# EAGLE schematic Rev A (EAGLE 6.4)
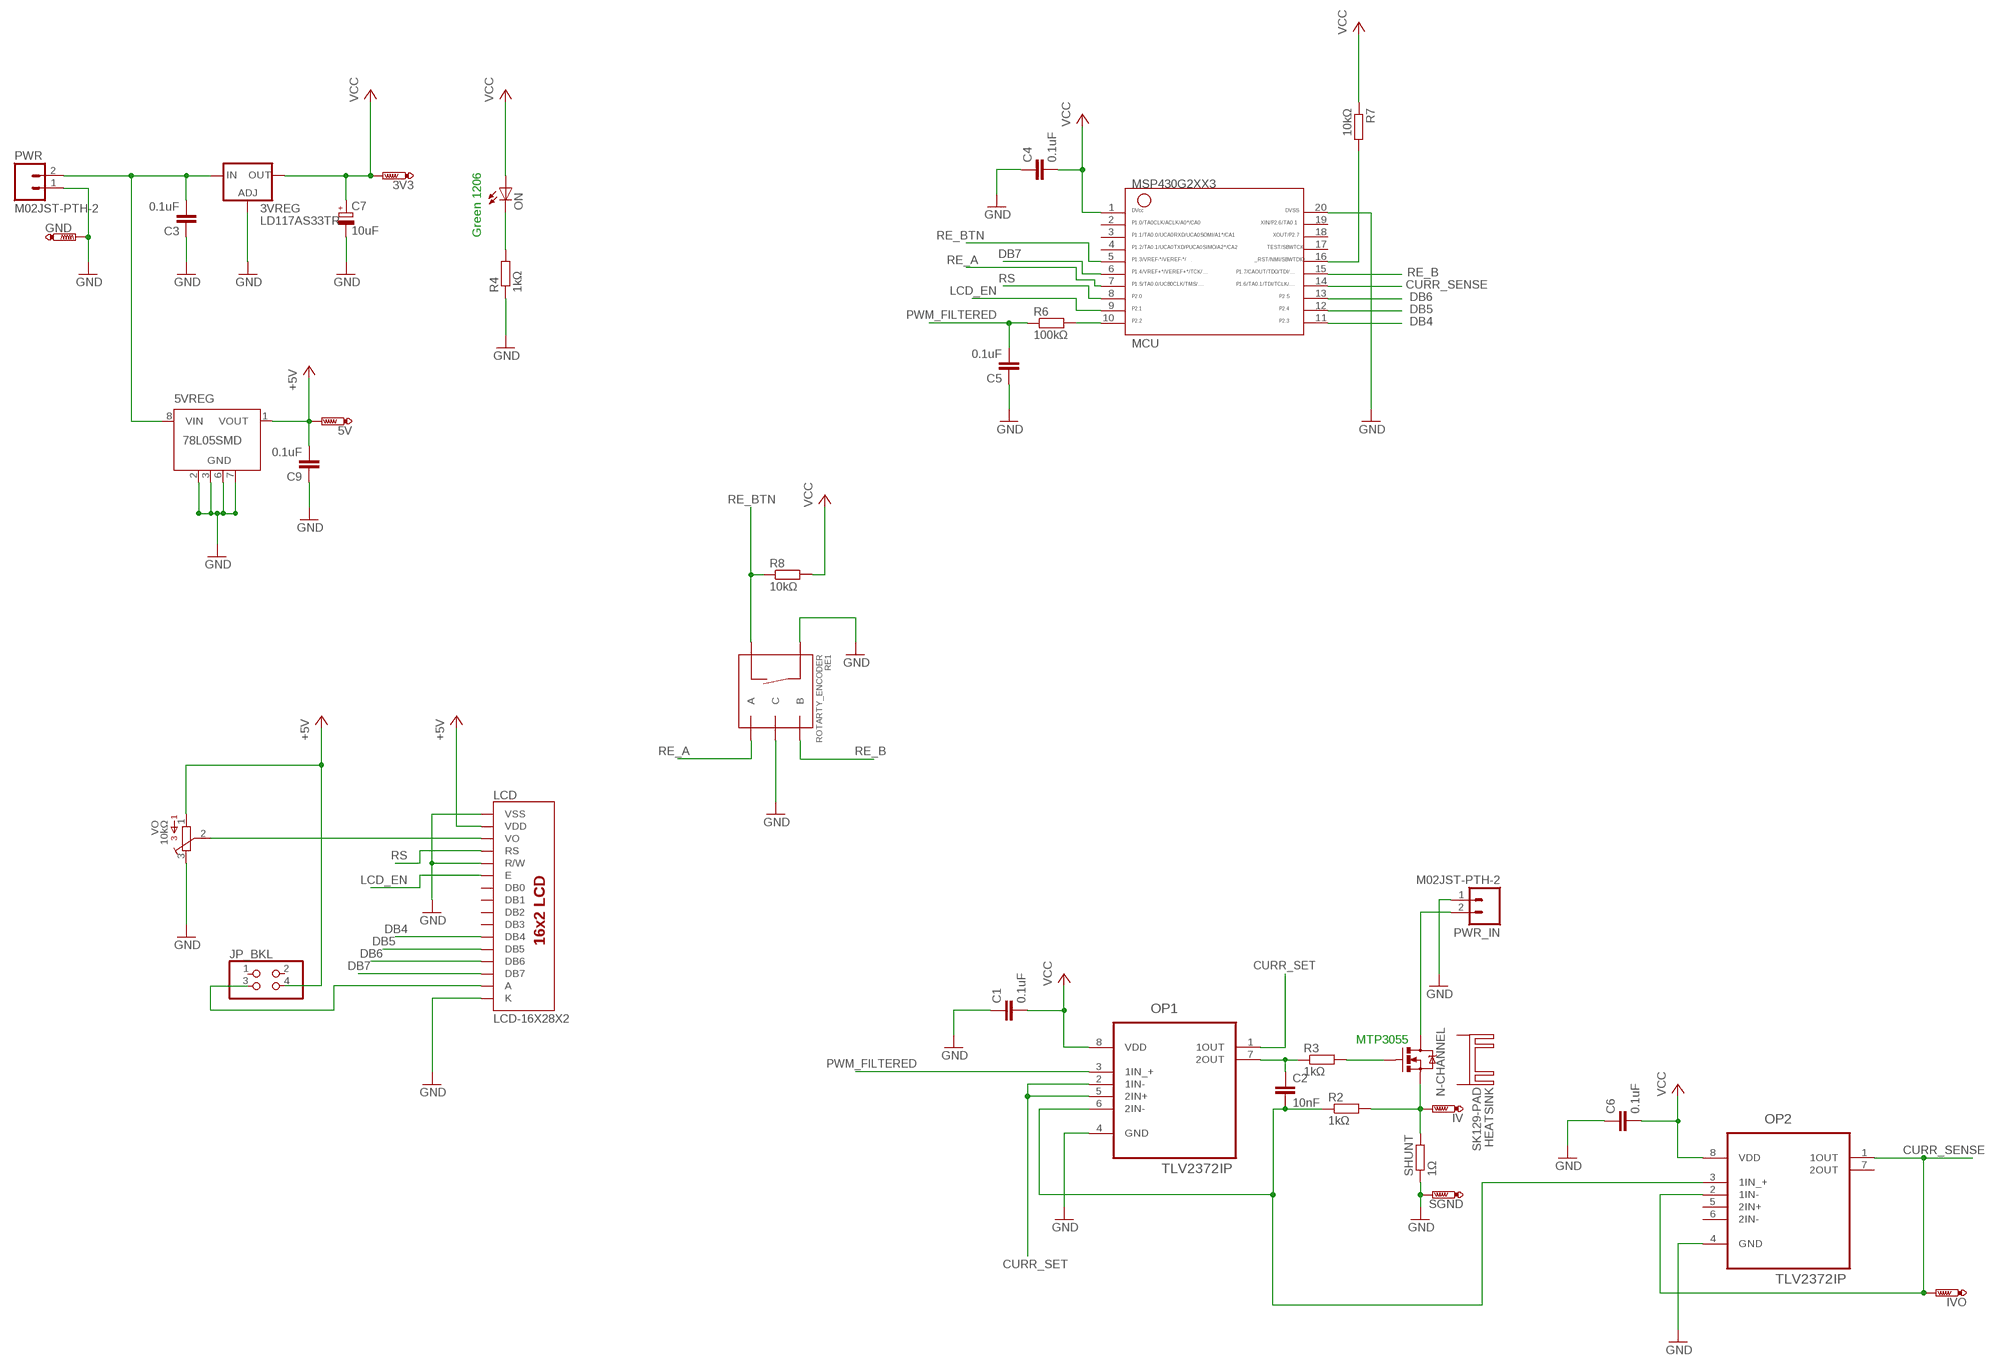
[diagram p0: schematic, sheet 1]

## Parts
3V3  PTR1TP10SQ  [TP10SQ]
3VREG  LD117AS33TR  [SOT223]
5V  PTR1TP10SQ  [TP10SQ]
5VREG  78L05SMD  [SO08]
C1  0.1uF  C-EUC0805  [C0805]
C2  10nF  C-EUC0805  [C0805]
C3  0.1uF  C-EUC0805  [C0805]
C4  0.1uF  C-EUC0805  [C0805]
C5  0.1uF  C-EUC0805  [C0805]
C6  0.1uF  C-EUC0805  [C0805]
C7  10uF  CPOL-EUE2.5-6  [E2,5-6]
C9  0.1uF  C-EUC0805  [C0805]
GND  PTR1TP10SQ  [TP10SQ]
HEATSINK  SK129-PAD  [SK129]
IV  PTR1TP10SQ  [TP10SQ]
IVO  PTR1TP10SQ  [TP10SQ]
JP_BKL  PINHD-2X2  [2X02]
LCD  LCD-16X28X2  [LCD-8X2]
MCU  G2XX3---N20  [N20]
N-CHANNEL  MOSFET-NCHANNELFQP30N06L  [TO220V]
ON  LEDCHIPLED_1206  [CHIPLED_1206]
OP1  TLV2372IP  [DIP254P762X508-8]
OP2  TLV2372IP  [DIP254P762X508-8]
PWR  M02JST-PTH-2  [JST-2-PTH]
PWR_IN  M02JST-PTH-2  [JST-2-PTH]
R2  1kΩ  R-EU_R0805  [R0805]
R3  1kΩ  R-EU_R0805  [R0805]
R4  1kΩ  R-EU_R0805  [R0805]
R6  100kΩ  R-EU_R0805  [R0805]
R7  10kΩ  R-EU_R0805  [R0805]
R8  10kΩ  R-EU_R0805  [R0805]
RE1  ROTARTY_ENCODER  [ROTARY_ENC_PLAIN]
SGND  PTR1TP10SQ  [TP10SQ]
SHUNT  1Ω  R-EU_VTA52  [VTA52]
VO  10kΩ  3386-G  [3386G]

## Nets
+5V: 5V.TP 5VREG.1(VOUT) C9.2 JP_BKL.4 LCD.2(VDD) VO.1
CURR_SENSE: IVO.TP MCU.14 OP2.1(1OUT) OP2.2(1IN-)
CURR_SET: OP1.1(1OUT) OP1.2(1IN-) OP1.5(2IN+)
DB4: LCD.11(DB4) MCU.11
DB5: LCD.12(DB5) MCU.12
DB6: LCD.13(DB6) MCU.13
DB7: LCD.14(DB7) MCU.6
GND: 3VREG.1(ADJ) 5VREG.2(GND) 5VREG.3(GND) 5VREG.6(GND) 5VREG.7(GND) C1.1 C3.1 C4.1 C5.1 C6.1 C7.- C9.1 GND.TP LCD.1(VSS) LCD.5(R/W) LCD.16(K) MCU.20 OP1.4(GND) OP2.4(GND) PWR.1 PWR_IN.1 R4.1 RE1.C RE1.SW+ SGND.TP SHUNT.1 VO.3
LCD_EN: LCD.6(E) MCU.9
N$1: C2.2 OP1.6(2IN-) OP2.3(1IN_+) R2.1
N$3: N-CHANNEL.1(G) R3.2
N$4: C2.1 OP1.7(2OUT) R3.1
N$6: 3VREG.3(IN) 5VREG.8(VIN) C3.2 PWR.2
N$7: ON.C R4.2
N$8: MCU.10 R6.2
N$9: MCU.16 R7.2
N$10: LCD.3(VO) VO.2
N$11: JP_BKL.3 LCD.15(A)
N$13: IV.TP N-CHANNEL.3(S) R2.2 SHUNT.2
PWM_FILTERED: C5.2 OP1.3(1IN_+) R6.1
RE_A: MCU.7 RE1.A
RE_B: MCU.15 RE1.B
RE_BTN: MCU.5 R8.1 RE1.SW-
RS: LCD.4(RS) MCU.8
TVIN: N-CHANNEL.2(D) PWR_IN.2
VCC: 3V3.TP 3VREG.4(OUT) C1.2 C4.2 C6.2 C7.+ MCU.1 ON.A OP1.8(VDD) OP2.8(VDD) R7.1 R8.2
Unconnected: 5VREG.4(NC) 5VREG.5(NC) HEATSINK.A2,5(K) HEATSINK.B2,5(K) JP_BKL.1 JP_BKL.2 LCD.7(DB0) LCD.8(DB1) LCD.9(DB2) LCD.10(DB3) MCU.2 MCU.3 MCU.4 MCU.17 MCU.18 MCU.19 OP2.5(2IN+) OP2.6(2IN-) OP2.7(2OUT)

## Notes on the sheet
- Green 1206
- MTP3055

## Library data of the parts
3V3 5V GND IV IVO SGND = testpad:PTR1: TEST PIN
3VREG = v-reg:LD117A?*: Low drop fixed and adjustable positive voltage regulators 1 A Source: http://www.st.com/stonline/products/literature/ds/7194/ld1117axx.pdf
5VREG = linear:78L*SMD: Positive VOLTAGE REGULATOR
C1-C6 C9 = rcl:C-EU: CAPACITOR, European symbol
C7 = rcl:CPOL-EU: POLARIZED CAPACITOR, European symbol
HEATSINK = heatsink:SK129-PAD: HEATSINK manufacturer Fischer/distributor Buerklin
JP_BKL = pinhead:PINHD-2X2: PIN HEADER
LCD = SparkFun-Displays:LCD-16X2: Standard text-only 16x2 parallel input LCD
MCU = TI_MSP430_v16:G2XX3---N20: MSP430G2XX1 PDIP (N) 20 Pin Package
N-CHANNEL = SparkFun-DiscreteSemi:MOSFET-NCHANNEL: Common NMOSFET Parts MFG P/N Store ID Prod ID FDD8780 TRANS-09984 SI7820DN TRANS-11055 FDS6630A IC-08089 2N7002PW TRANS-11151 FQP30N06L COM-10213 TRANS-10060 BSS123LT1G TRANS-08345 BSS138 TRANS-00830 BS170 2N7000; PROD_ID: TRANS-10060
ON = led:LED: LED OSRAM: - CHIPLED LG R971, LG N971, LY N971, LG Q971, LY Q971, LO R971, LY R971 LH N974, LH R974 LS Q976, LO Q976, LY Q976 LO Q996 - Hyper CHIPLED LW Q18S LB Q993, LB Q99A, LB R99A - SideLED LS A670, LO A670, LY A670, LG A670, LP A670 LB A673, LV A673, LT A673, LW A673 LH A674 LY A675 LS A676, LA A676, LO A676, LY A676, LW A676 LS A679, LY A679, LG A679 - Hyper Micro SIDELED® LS Y876, LA Y876, LO Y876, LY Y876 LT Y87S - SmartLED LW L88C, LW L88S LB L89C, LB L89S, LG L890 LS L89K, LO L89K, LY L89K LS L896, LA L896, LO L896, LY L896 - TOPLED LS T670, LO T670, LY T670, LG T670, LP T670 LSG T670, LSP T670, LSY T670, LOP T670, LYG T670 LG T671, LOG T671, LSG T671 LB T673, LV T673, LT T673, LW T673 LH T674 LS T676, LA T676, LO T676, LY T676, LB T676, LH T676, LSB T676, LW T676 LB T67C, LV T67C, LT T67C, LS T67K, LO T67K, LY T67K, LW E67C LS E67B, LA E67B, LO E67B, LY E67B, LB E67C, LV E67C, LT E67C LW T67C LS T679, LY T679, LG T679 LS T770, LO T770, LY T770, LG T770, LP T770 LB T773, LV T773, LT T773, LW T773 LH T774 LS E675, LA E675, LY E675, LS T675 LS T776, LA T776, LO T776, LY T776, LB T776 LHGB T686 LT T68C, LB T68C - Hyper Mini TOPLED® LB M676 - Mini TOPLED Santana® LG M470 LS M47K, LO M47K, LY M47K Source: http://www.osram.convergy.de LUXEON: - LUMILED® LXK2-PW12-R00, LXK2-PW12-S00, LXK2-PW14-U00, LXK2-PW14-V00 LXK2-PM12-R00, LXK2-PM12-S00, LXK2-PM14-U00 LXK2-PE12-Q00, LXK2-PE12-R00, LXK2-PE12-S00, LXK2-PE14-T00, LXK2-PE14-U00 LXK2-PB12-K00, LXK2-PB12-L00, LXK2-PB12-M00, LXK2-PB14-N00, LXK2-PB14-P00, LXK2-PB14-Q00 LXK2-PR12-L00, LXK2-PR12-M00, LXK2-PR14-Q00, LXK2-PR14-R00 LXK2-PD12-Q00, LXK2-PD12-R00, LXK2-PD12-S00 LXK2-PH12-R00, LXK2-PH12-S00 LXK2-PL12-P00, LXK2-PL12-Q00, LXK2-PL12-R00 Source: www.luxeon.com KINGBRIGHT: KA-3528ASYC Source: www.kingbright.com
OP1 OP2 = Texas Instruments_By_element14_Batch_1:TLV2372IP: OPERATIONAL AMPLIFIER; MPN: TLV2372IP; OC_FARNELL: 8455031; OC_NEWARK: 76C7976; PACKAGE: PDIP; SUPPLIER: Texas Instruments
PWR PWR_IN = SparkFun-Connectors:M02: Standard 2-pin 0.1" header. Use with - straight break away headers ( PRT-00116) - right angle break away headers (PRT-00553) - swiss pins (PRT-00743) - machine pins (PRT-00117) - female headers (PRT-00115) Molex polarized connector foot print use with: PRT-08233 with associated crimp pins and housings. 2.54_SCREWTERM for use with PRT-10571. 3.5mm Screw Terminal footprints for PRT-08084 5mm Screw Terminal footprints for use with PRT-08433
R2-R4 R6 R8 SHUNT = rcl:R-EU_: RESISTOR, European symbol
R7 = resistor:R-EU_: RESISTOR, European symbol
RE1 = SparkFun-Electromechanical:ROTARTY_ENCODER: Simple no LED rotary encoder Example: COM-09117
VO = bourns:3386-: 3386 Series 3/8" Square Trimmer